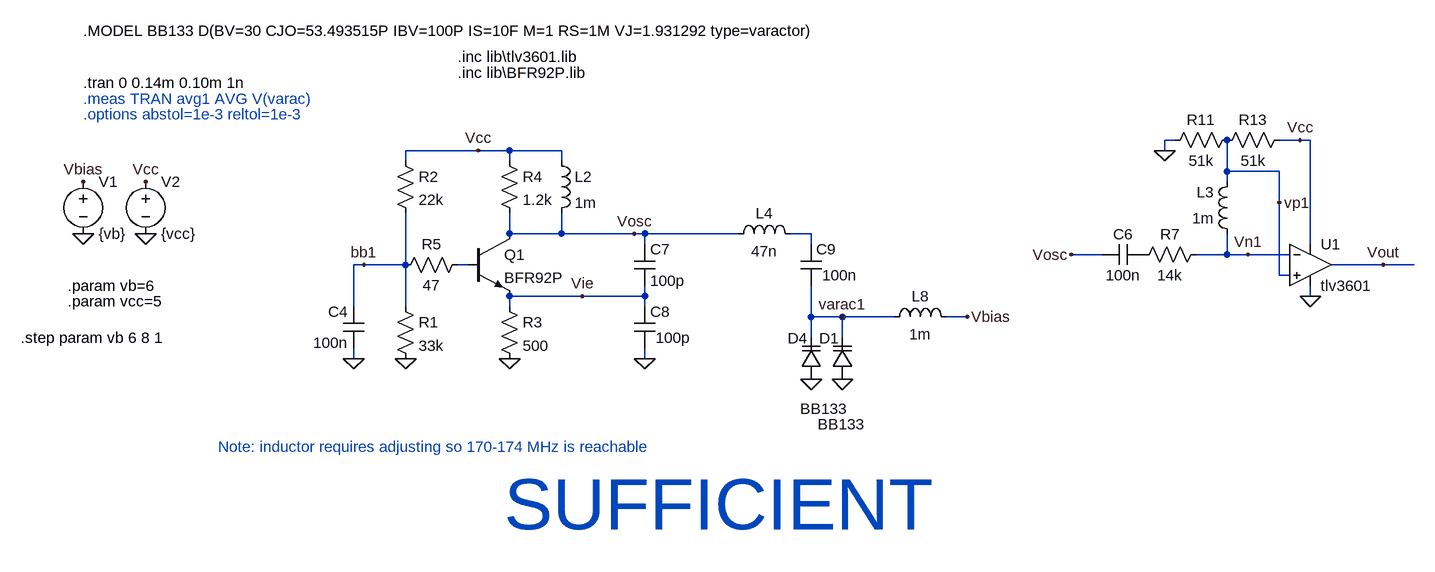
[diagram p0: schematic LO_VCO_module.asc]
LO_VCO_module.asc, the LTspice schematic file:
Version 4.1
SHEET 1 2860 1088
WIRE 1888 -128 1872 -128
WIRE 2080 -128 2048 -128
WIRE 2096 -128 2080 -128
WIRE 816 -112 704 -112
WIRE 864 -112 816 -112
WIRE 944 -112 864 -112
WIRE 1872 -112 1872 -128
WIRE 704 -96 704 -112
WIRE 864 -96 864 -112
WIRE 944 -96 944 -112
WIRE 1968 -80 1968 -128
WIRE 2048 -80 1968 -80
WIRE 1968 -64 1968 -80
WIRE 2048 -32 2048 -80
WIRE 864 16 864 -16
WIRE 944 16 944 -16
WIRE 944 16 864 16
WIRE 1056 16 944 16
WIRE 1072 16 1056 16
WIRE 1216 16 1072 16
WIRE 1328 16 1296 16
WIRE 1072 32 1072 16
WIRE 1328 32 1328 16
WIRE 2096 32 2096 -128
WIRE 1776 48 1728 48
WIRE 1968 48 1968 16
WIRE 1968 48 1920 48
WIRE 2000 48 1968 48
WIRE 2064 48 2000 48
WIRE 640 64 624 64
WIRE 704 64 704 -16
WIRE 704 64 640 64
WIRE 800 64 784 64
WIRE 2208 64 2128 64
WIRE 2256 64 2208 64
WIRE 2048 80 2048 -32
WIRE 2064 80 2048 80
WIRE 976 112 864 112
WIRE 1072 112 1072 96
WIRE 1072 112 976 112
WIRE 2096 112 2096 96
WIRE 624 128 624 64
WIRE 704 128 704 64
WIRE 864 128 864 112
WIRE 1072 128 1072 112
WIRE 1328 144 1328 96
WIRE 1376 144 1328 144
WIRE 1456 144 1376 144
WIRE 1568 144 1536 144
WIRE 1328 176 1328 144
WIRE 1376 176 1376 144
WIRE 624 208 624 192
WIRE 1072 208 1072 192
FLAG 208 16 0
FLAG 304 16 0
FLAG 304 -64 Vcc
FLAG 208 -64 Vbias
FLAG 704 208 0
FLAG 624 208 0
FLAG 816 -112 Vcc
FLAG 864 208 0
FLAG 640 64 bb1
FLAG 2208 64 Vout
FLAG 2096 112 0
FLAG 1872 -112 0
FLAG 2000 48 Vn1
FLAG 2080 -128 Vcc
FLAG 1056 16 Vosc
FLAG 976 112 Vie
FLAG 2048 -32 vp1
FLAG 1072 208 0
FLAG 1568 144 Vbias
FLAG 1328 240 0
FLAG 1376 144 varac1
FLAG 1728 48 Vosc
FLAG 1376 240 0
SYMBOL npn 800 16 R0
SYMATTR InstName Q1
SYMATTR Value BFR92P
SYMATTR Prefix X
SYMBOL voltage 208 -80 R0
WINDOW 123 0 0 Left 0
WINDOW 39 0 0 Left 0
SYMATTR InstName V1
SYMATTR Value {vb}
SYMBOL voltage 304 -80 R0
WINDOW 123 0 0 Left 0
WINDOW 39 40 66 Left 2
SYMATTR InstName V2
SYMATTR Value {vcc}
SYMBOL ind 928 -112 R0
SYMATTR InstName L2
SYMATTR Value 1m
SYMATTR SpiceLine Rser=10
SYMBOL res 688 112 R0
SYMATTR InstName R1
SYMATTR Value 33k
SYMBOL res 688 -112 R0
SYMATTR InstName R2
SYMATTR Value 22k
SYMBOL res 848 112 R0
SYMATTR InstName R3
SYMATTR Value 500
SYMBOL cap 640 192 R180
WINDOW 0 24 56 Left 2
WINDOW 3 24 8 Left 2
SYMATTR InstName C4
SYMATTR Value 100n
SYMBOL res 800 48 R90
WINDOW 0 0 56 VBottom 2
WINDOW 3 32 56 VTop 2
SYMATTR InstName R5
SYMATTR Value 47
SYMBOL cap 1840 32 R90
WINDOW 0 0 32 VBottom 2
WINDOW 3 32 32 VTop 2
SYMATTR InstName C6
SYMATTR Value 100n
SYMBOL res 1936 32 R90
WINDOW 0 0 56 VBottom 2
WINDOW 3 32 56 VTop 2
SYMATTR InstName R7
SYMATTR Value 14k
SYMBOL res 1984 -144 R90
WINDOW 0 0 56 VBottom 2
WINDOW 3 32 56 VTop 2
SYMATTR InstName R11
SYMATTR Value 51k
SYMBOL res 2064 -144 R90
WINDOW 0 0 56 VBottom 2
WINDOW 3 32 56 VTop 2
SYMATTR InstName R13
SYMATTR Value 51k
SYMBOL res 848 -112 R0
SYMATTR InstName R4
SYMATTR Value 1.2k
SYMBOL ind 1984 32 R180
WINDOW 0 36 80 Left 2
WINDOW 3 36 40 Left 2
SYMATTR InstName L3
SYMATTR Value 1m
SYMATTR SpiceLine Rser=10
SYMBOL varactor 1344 240 R180
WINDOW 0 21 63 Left 2
WINDOW 3 -39 -45 Left 2
SYMATTR InstName D4
SYMATTR Value BB133
SYMBOL cap 1056 32 R0
SYMATTR InstName C7
SYMATTR Value 100p
SYMBOL cap 1056 128 R0
WINDOW 3 33 48 Left 2
SYMATTR Value 100p
SYMATTR InstName C8
SYMBOL ind 1200 32 R270
WINDOW 0 32 56 VTop 2
WINDOW 3 5 56 VBottom 2
SYMATTR InstName L4
SYMATTR Value 47n
SYMBOL ind 1440 160 R270
WINDOW 0 32 56 VTop 2
WINDOW 3 5 56 VBottom 2
SYMATTR InstName L8
SYMATTR Value 1m
SYMATTR SpiceLine Rser=10
SYMBOL cap 1312 32 R0
WINDOW 3 33 48 Left 2
SYMATTR Value 100n
SYMATTR InstName C9
SYMBOL OpAmps\\opamp2 2096 0 R0
SYMATTR InstName U1
SYMATTR Value tlv3601
SYMBOL varactor 1392 240 R180
WINDOW 0 21 63 Left 2
WINDOW 3 -18 -69 Left 2
SYMATTR InstName D1
SYMATTR Value BB133
TEXT 112 176 Left 2 !.step param vb 6 8 1
TEXT 208 -192 Left 2 ;.meas TRAN avg1 AVG V(varac)
TEXT 184 96 Left 2 !.param vb=6
TEXT 208 -168 Left 2 ;.options abstol=1e-3 reltol=1e-3
TEXT 784 -232 Left 2 !.inc lib\\BFR92P.lib
TEXT 208 -216 Left 2 !.tran 0 0.14m 0.10m 1n
TEXT 184 120 Left 2 !.param vcc=5
TEXT 208 -296 Left 2 !.MODEL BB133 D(BV=30 CJO=53.493515P IBV=100P IS=10F M=1 RS=1M VJ=1.931292 type=varactor)
TEXT 784 -256 Left 2 !.inc lib\\tlv3601.lib
TEXT 856 432 Left 7 ;SUFFICIENT
TEXT 416 344 Left 2 ;Note: inductor requires adjusting so 170-174 MHz is reachable

The netlist it stands for:
* LO_VCO_module.asc
X§Q1 Vosc N002 Vie BFR92P  ; pins C B E
V1 Vbias 0 {vb}
V2 Vcc 0 {vcc}
L2 Vcc Vosc 1m Rser=10
R1 bb1 0 33k
R2 Vcc bb1 22k
R3 Vie 0 500
C4 0 bb1 100n
R5 N002 bb1 47
C6 P001 Vosc 100n
R7 Vn1 P001 14k
R11 vp1 0 51k
R13 Vcc vp1 51k
R4 Vcc Vosc 1.2k
L3 Vn1 vp1 1m Rser=10
D4 0 varac1 BB133
C7 Vosc Vie 100p
C8 Vie 0 100p
L4 Vosc N001 47n
L8 varac1 Vbias 1m Rser=10
C9 N001 varac1 100n
X§U1 vp1 Vn1 Vcc 0 Vout tlv3601  ; pins In+ In- V+ V- OUT
D1 0 varac1 BB133
.model D D
.lib standard.dio
.step param vb 6 8 1
* .meas TRAN avg1 AVG V(varac)
.param vb=6
* .options abstol=1e-3 reltol=1e-3
.inc lib\BFR92P.lib
.tran 0 0.14m 0.10m 1n
.param vcc=5
.MODEL BB133 D(BV=30 CJO=53.493515P IBV=100P IS=10F M=1 RS=1M VJ=1.931292 type=varactor)
.inc lib\tlv3601.lib
* SUFFICIENT
* Note: inductor requires adjusting so 170-174 MHz is reachable
.backanno
.end